# Altium schematic sheet Overall_System.SchDoc
size A
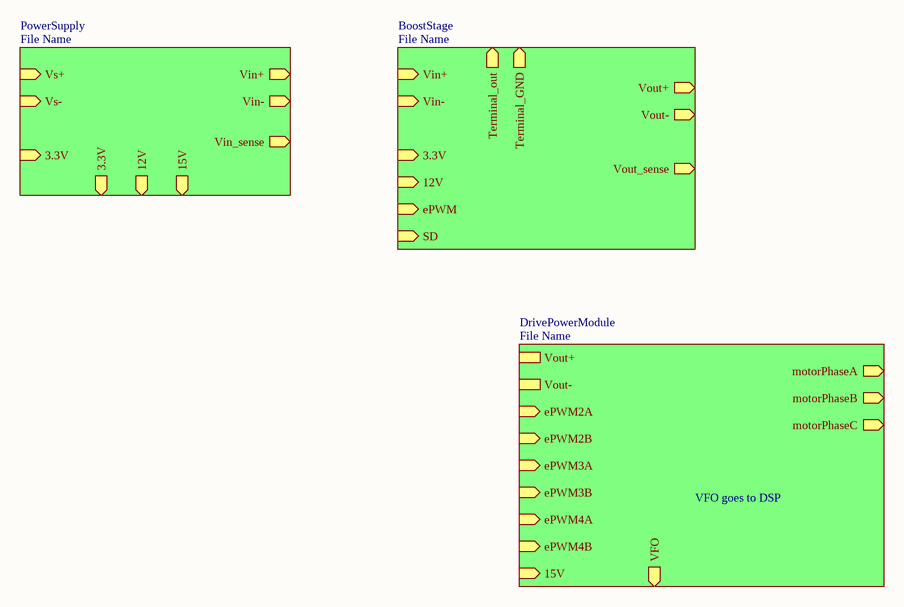
[diagram p0: Overall_System.SchDoc]

## Sub-sheets
BoostStage = File Name: Vin+ (in), Vin- (in), 12V (in), ePWM (in), SD (in), Terminal_out (out), Terminal_GND (out), 3.3V (in), Vout+ (out), Vout- (out), Vout_sense (out)
DrivePowerModule = File Name: ePWM2A (in), ePWM2B (in), ePWM3A (in), ePWM3B (in), ePWM4A (in), ePWM4B (in), motorPhaseB (out), motorPhaseA (out), motorPhaseC (out), 15V (in), VFO (out), Vout+, Vout-
PowerSupply = File Name: Vs+ (in), Vs- (in), Vin+ (out), Vin- (out), 3.3V (out), 12V (out), 15V (out), Vin_sense (out), 3.3V (in)

## Notes on the sheet
- VFO goes to DSP